# Altium schematic sheet 53-BLANK 161-180.SchDoc
size 594 x 420 mm
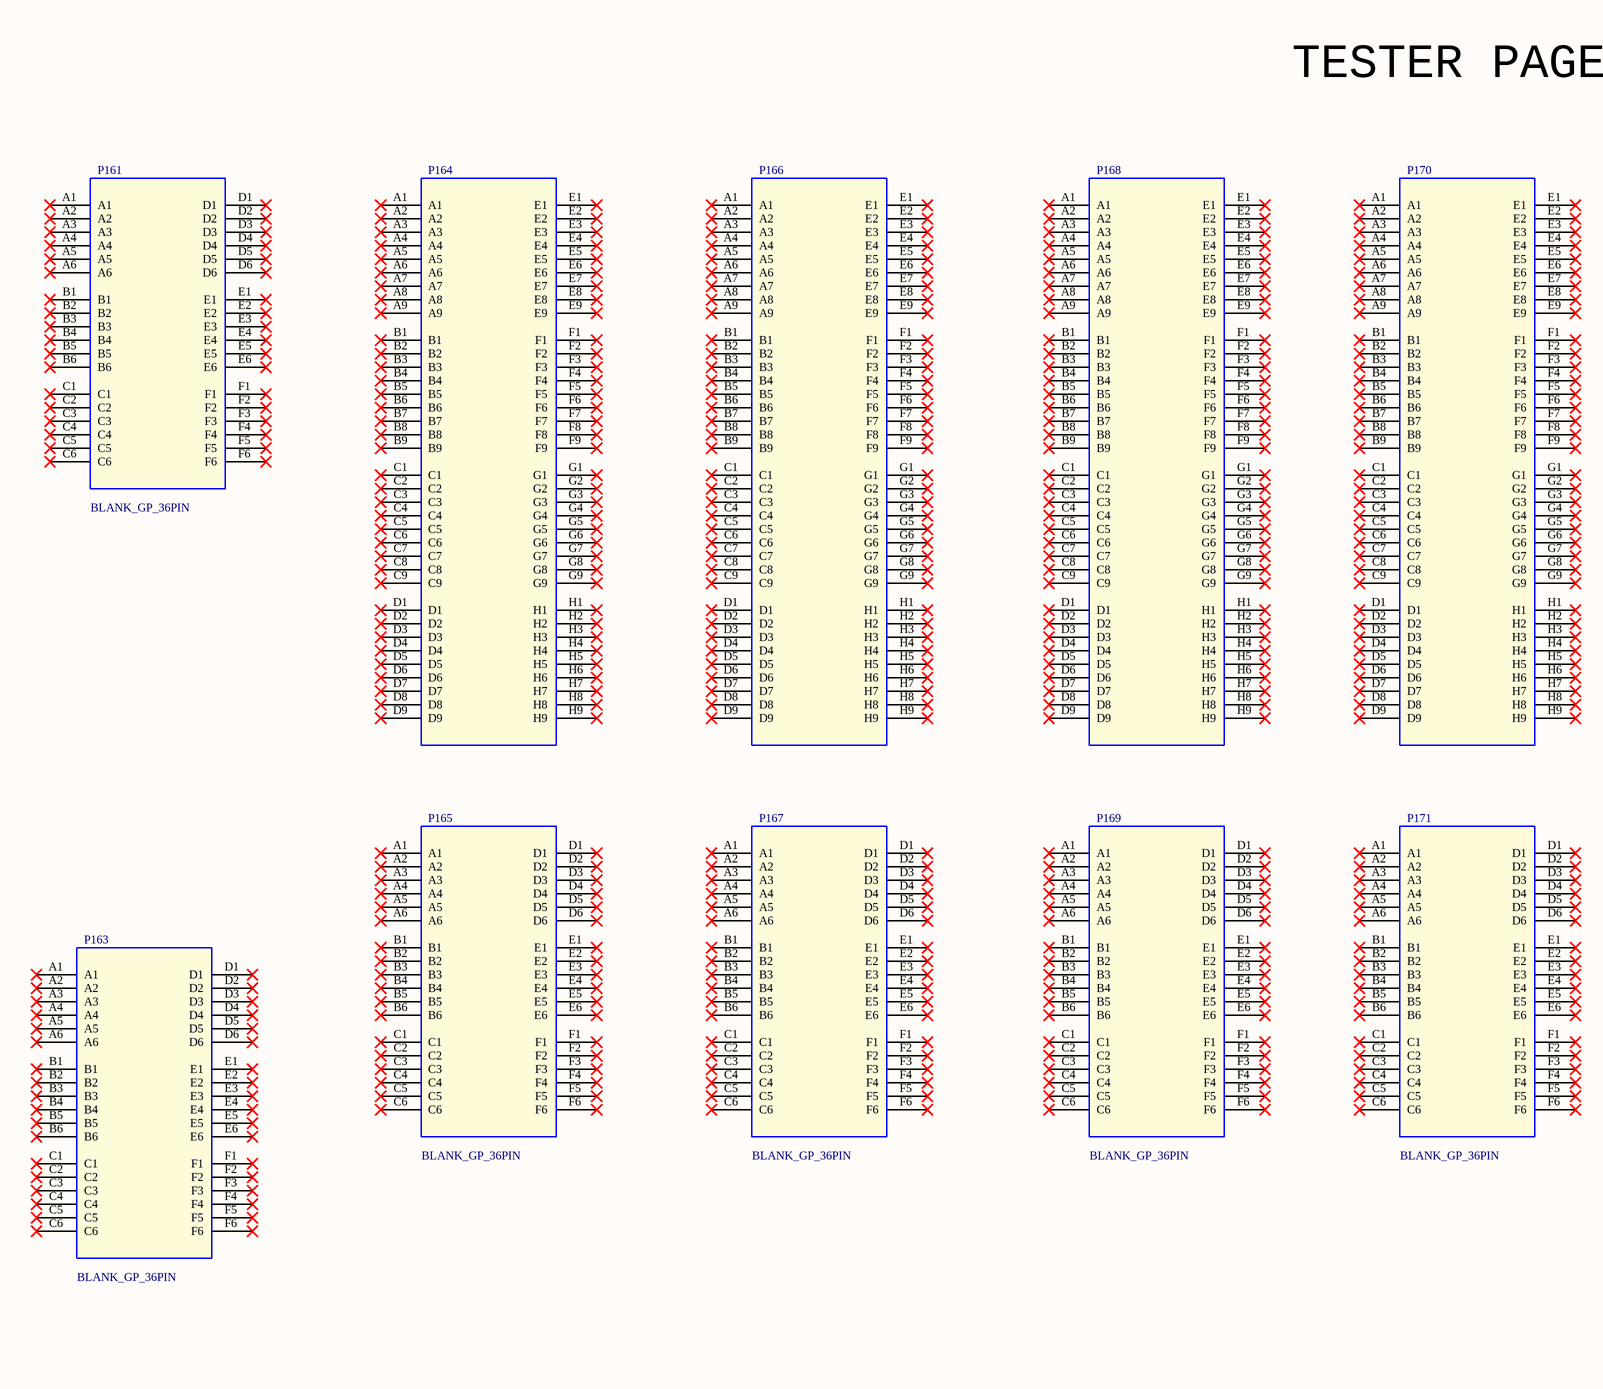
[diagram p0: 53-BLANK 161-180.SchDoc, left]
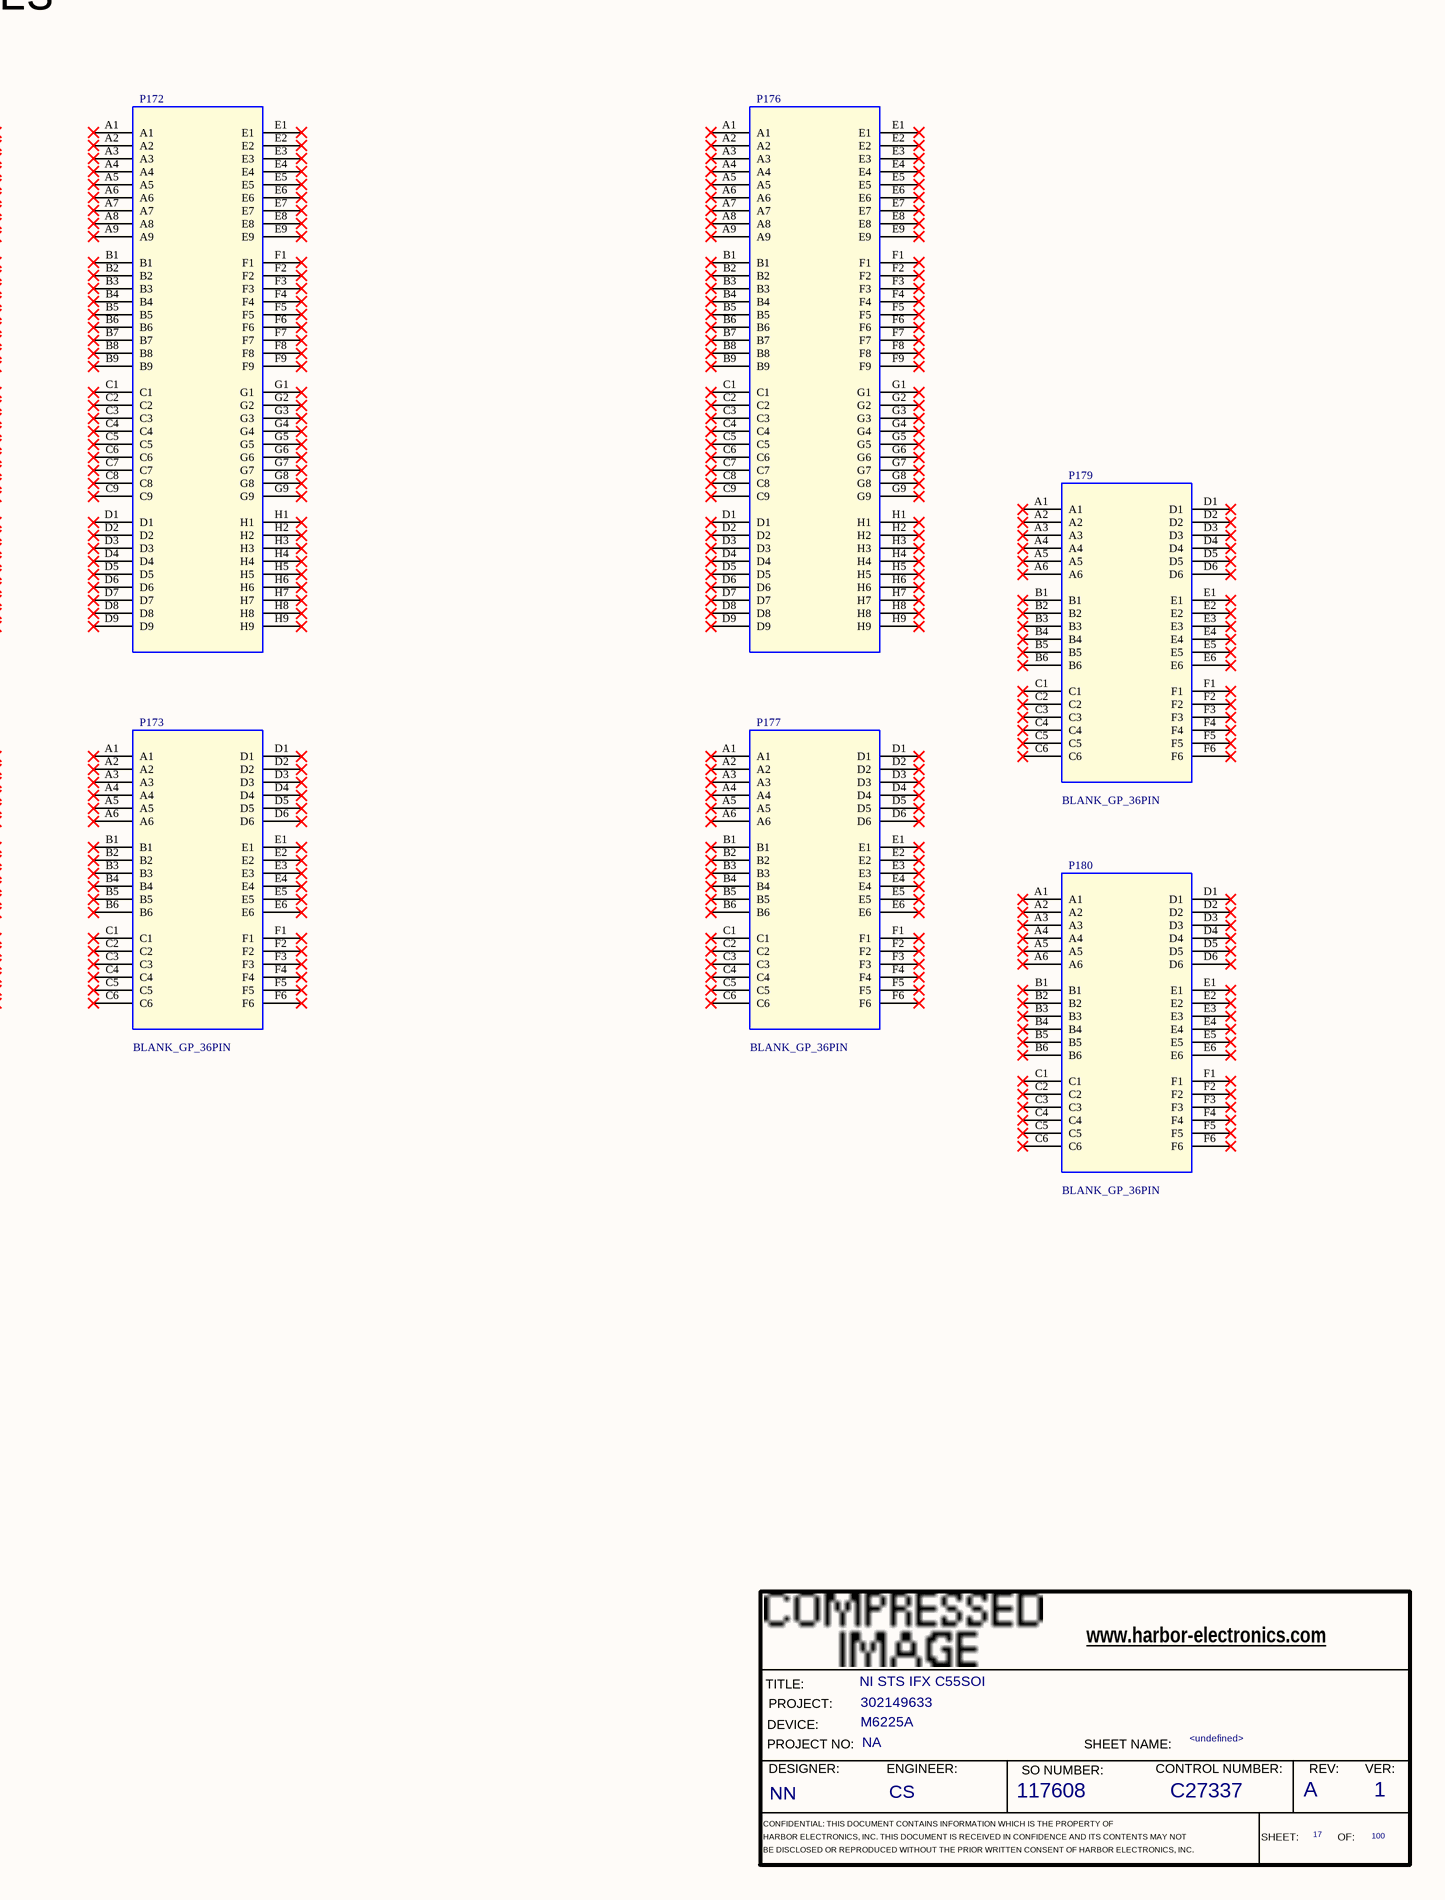
[diagram p1: 53-BLANK 161-180.SchDoc, right]

## Parts
*  RevCode: A  Title: NI STS IFX C55SOI  Page Number: 17  Page Count: 100  Engineer: CS  Designer: NN  SO Number: 117608  Control Number: C27337  Version: 1  Page Name: <undefined>  PROJECT: 302149633  DEVICE: M6225A  PROJECT NO.: NA  (hidden comment: HE_DEFAULT)  (graphical)
P161  BLANK_GP_36PIN  [285092A-08_36PIN_NOVIA]
P163  BLANK_GP_36PIN  [285092A-08_36PIN_NOVIA]
P164  (no value)  [285092A-08_72PIN_NOVIA]
P165  BLANK_GP_36PIN  [285092A-08_36PIN_NOVIA]
P166  (no value)  [285092A-08_72PIN_NOVIA]
P167  BLANK_GP_36PIN  [285092A-08_36PIN_NOVIA]
P168  (no value)  [285092A-08_72PIN_NOVIA]
P169  BLANK_GP_36PIN  [285092A-08_36PIN_NOVIA]
P170  (no value)  [285092A-08_72PIN_NOVIA]
P171  BLANK_GP_36PIN  [285092A-08_36PIN_NOVIA]
P172  (no value)  [285092A-08_72PIN_NOVIA]
P173  BLANK_GP_36PIN  [285092A-08_36PIN_NOVIA]
P176  (no value)  [285092A-08_72PIN_NOVIA]
P177  BLANK_GP_36PIN  [285092A-08_36PIN_NOVIA]
P179  BLANK_GP_36PIN  [285092A-08_36PIN_NOVIA]
P180  BLANK_GP_36PIN  [285092A-08_36PIN_NOVIA]

## Nets

Not connected (* = marked no-connect by the designer): P161 A1* A2* A3* A4* A5* A6* B1* B2* B3* B4* B5* B6* C1* C2* C3* C4* C5* C6* D1* D2* D3* D4* D5* D6* E1* E2* E3* E4* E5* E6* F1* F2* F3* F4* F5* F6*; P163 A1* A2* A3* A4* A5* A6* B1* B2* B3* B4* B5* B6* C1* C2* C3* C4* C5* C6* D1* D2* D3* D4* D5* D6* E1* E2* E3* E4* E5* E6* F1* F2* F3* F4* F5* F6*; P164 A1* A2* A3* A4* A5* A6* A7* A8* A9* B1* B2* B3* B4* B5* B6* B7* B8* B9* C1* C2* C3* C4* C5* C6* C7* C8* C9* D1* D2* D3* D4* D5* D6* D7* D8* D9* E1* E2* E3* E4* E5* E6* E7* E8* E9* F1* F2* F3* F4* F5* F6* F7* F8* F9* G1* G2* G3* G4* G5* G6* G7* G8* G9* H1* H2* H3* H4* H5* H6* H7* H8* H9*; P165 A1* A2* A3* A4* A5* A6* B1* B2* B3* B4* B5* B6* C1* C2* C3* C4* C5* C6* D1* D2* D3* D4* D5* D6* E1* E2* E3* E4* E5* E6* F1* F2* F3* F4* F5* F6*; P166 A1* A2* A3* A4* A5* A6* A7* A8* A9* B1* B2* B3* B4* B5* B6* B7* B8* B9* C1* C2* C3* C4* C5* C6* C7* C8* C9* D1* D2* D3* D4* D5* D6* D7* D8* D9* E1* E2* E3* E4* E5* E6* E7* E8* E9* F1* F2* F3* F4* F5* F6* F7* F8* F9* G1* G2* G3* G4* G5* G6* G7* G8* G9* H1* H2* H3* H4* H5* H6* H7* H8* H9*; P167 A1* A2* A3* A4* A5* A6* B1* B2* B3* B4* B5* B6* C1* C2* C3* C4* C5* C6* D1* D2* D3* D4* D5* D6* E1* E2* E3* E4* E5* E6* F1* F2* F3* F4* F5* F6*; P168 A1* A2* A3* A4* A5* A6* A7* A8* A9* B1* B2* B3* B4* B5* B6* B7* B8* B9* C1* C2* C3* C4* C5* C6* C7* C8* C9* D1* D2* D3* D4* D5* D6* D7* D8* D9* E1* E2* E3* E4* E5* E6* E7* E8* E9* F1* F2* F3* F4* F5* F6* F7* F8* F9* G1* G2* G3* G4* G5* G6* G7* G8* G9* H1* H2* H3* H4* H5* H6* H7* H8* H9*; P169 A1* A2* A3* A4* A5* A6* B1* B2* B3* B4* B5* B6* C1* C2* C3* C4* C5* C6* D1* D2* D3* D4* D5* D6* E1* E2* E3* E4* E5* E6* F1* F2* F3* F4* F5* F6*; P170 A1* A2* A3* A4* A5* A6* A7* A8* A9* B1* B2* B3* B4* B5* B6* B7* B8* B9* C1* C2* C3* C4* C5* C6* C7* C8* C9* D1* D2* D3* D4* D5* D6* D7* D8* D9* E1* E2* E3* E4* E5* E6* E7* E8* E9* F1* F2* F3* F4* F5* F6* F7* F8* F9* G1* G2* G3* G4* G5* G6* G7* G8* G9* H1* H2* H3* H4* H5* H6* H7* H8* H9*; P171 A1* A2* A3* A4* A5* A6* B1* B2* B3* B4* B5* B6* C1* C2* C3* C4* C5* C6* D1* D2* D3* D4* D5* D6* E1* E2* E3* E4* E5* E6* F1* F2* F3* F4* F5* F6*; P172 A1* A2* A3* A4* A5* A6* A7* A8* A9* B1* B2* B3* B4* B5* B6* B7* B8* B9* C1* C2* C3* C4* C5* C6* C7* C8* C9* D1* D2* D3* D4* D5* D6* D7* D8* D9* E1* E2* E3* E4* E5* E6* E7* E8* E9* F1* F2* F3* F4* F5* F6* F7* F8* F9* G1* G2* G3* G4* G5* G6* G7* G8* G9* H1* H2* H3* H4* H5* H6* H7* H8* H9*; P173 A1* A2* A3* A4* A5* A6* B1* B2* B3* B4* B5* B6* C1* C2* C3* C4* C5* C6* D1* D2* D3* D4* D5* D6* E1* E2* E3* E4* E5* E6* F1* F2* F3* F4* F5* F6*; P176 A1* A2* A3* A4* A5* A6* A7* A8* A9* B1* B2* B3* B4* B5* B6* B7* B8* B9* C1* C2* C3* C4* C5* C6* C7* C8* C9* D1* D2* D3* D4* D5* D6* D7* D8* D9* E1* E2* E3* E4* E5* E6* E7* E8* E9* F1* F2* F3* F4* F5* F6* F7* F8* F9* G1* G2* G3* G4* G5* G6* G7* G8* G9* H1* H2* H3* H4* H5* H6* H7* H8* H9*; P177 A1* A2* A3* A4* A5* A6* B1* B2* B3* B4* B5* B6* C1* C2* C3* C4* C5* C6* D1* D2* D3* D4* D5* D6* E1* E2* E3* E4* E5* E6* F1* F2* F3* F4* F5* F6*; P179 A1* A2* A3* A4* A5* A6* B1* B2* B3* B4* B5* B6* C1* C2* C3* C4* C5* C6* D1* D2* D3* D4* D5* D6* E1* E2* E3* E4* E5* E6* F1* F2* F3* F4* F5* F6*; P180 A1* A2* A3* A4* A5* A6* B1* B2* B3* B4* B5* B6* C1* C2* C3* C4* C5* C6* D1* D2* D3* D4* D5* D6* E1* E2* E3* E4* E5* E6* F1* F2* F3* F4* F5* F6*

## Notes on the sheet
- TESTER PAGES
- (in symbol HE_DEFAULT) www.harbor-electronics.com; TITLE:; PROJECT:; DEVICE:; PROJECT NO:; SHEET NAME:; DESIGNER:; ENGINEER:; SO NUMBER:; CONTROL NUMBER:; REV:; VER:; CONFIDENTIAL: THIS DOCUMENT CONTAINS INFORMATION WHICH IS THE PROPERTY OF; HARBOR ELECTRONICS, INC. THIS DOCUMENT IS RECEIVED IN CONFIDENCE AND ITS CONTENTS MAY NOT; SHEET:; OF:; BE DISCLOSED OR REPRODUCED WITHOUT THE PRIOR WRITTEN CONSENT OF HARBOR ELECTRONICS, INC.

## Library data of the parts
* = HE_DEFAULT: Page Size: X; OrgAddr4: Fax: +1 602-431-9633; OrgAddr1: 4050 E. Cotton Center Blvd., Suite 33; OrgAddr2: Phoenix, Arizona 85040 U.S.A.; OrgAddr3: Phone: +1 602-438-1112; Doc: <Title Name>; OrgName: HARBOR
P161 P163 P165 P167 P169 P171 P173 P177 P179 P180 = BLANK_GP_36PIN: ALT_SYMBOLS: 285092A-08_36PIN; PCB Footprint: 285092A-08_36PIN_NOVIA
P164 P166 P168 P170 P172 P176 = BLANK_COAX_72PIN: ALT_SYMBOLS: 285092A-08_72PIN; PCB Footprint: 285092A-08_72PIN_NOVIA